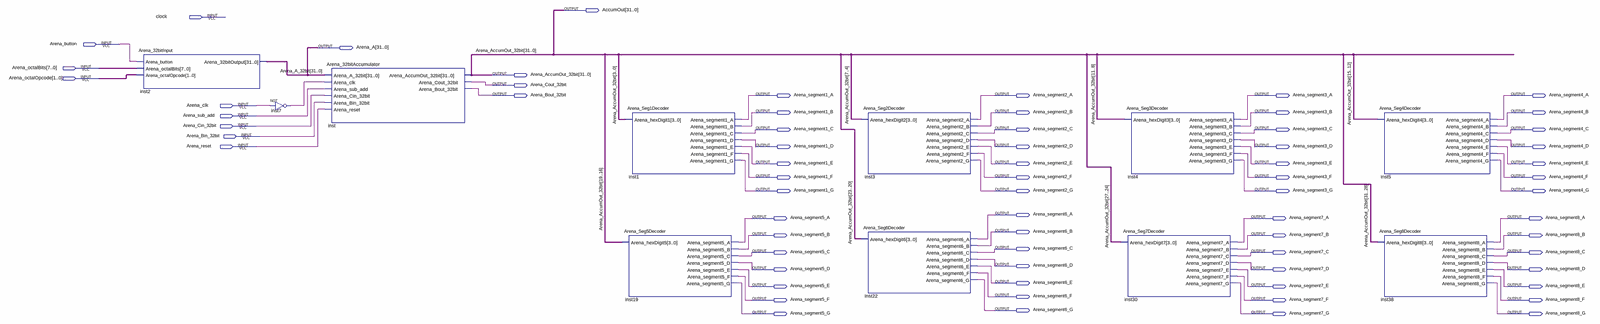
[diagram p0: schematic sheet, whole]
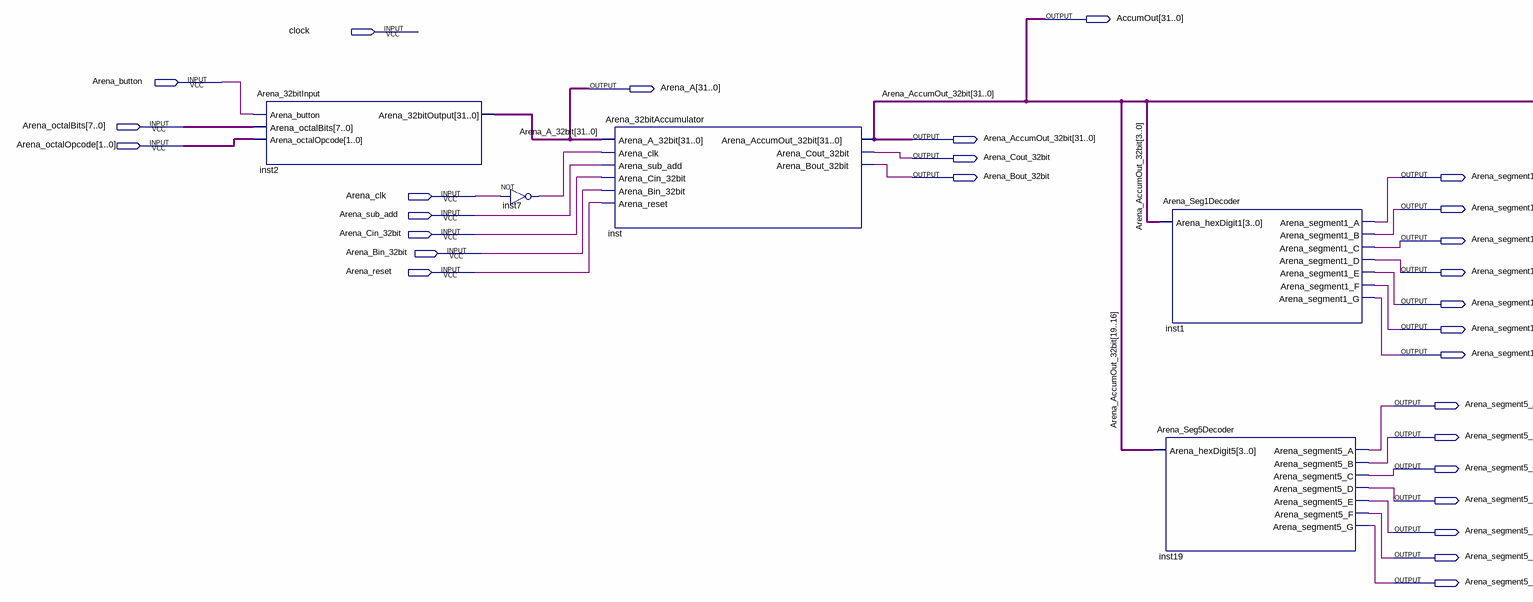
[diagram p1: schematic sheet, left part]
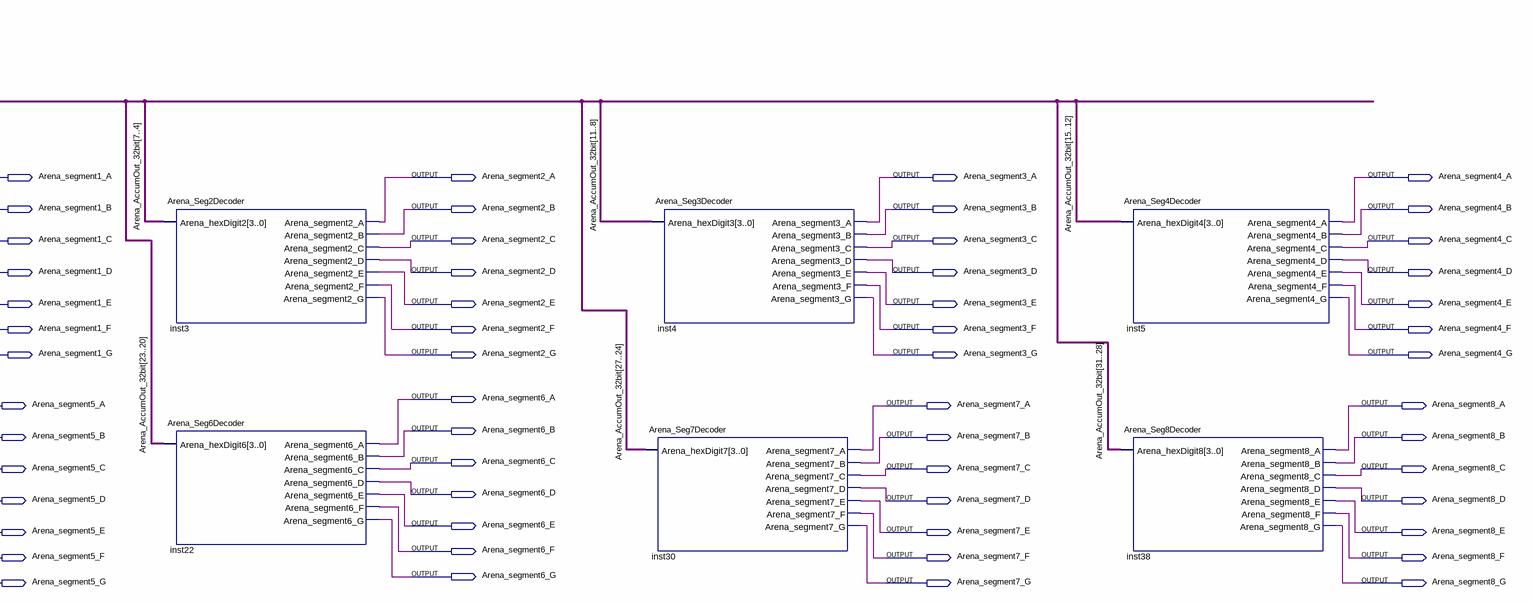
[diagram p2: schematic sheet, right part]
// Quartus schematic Arena_32bitAccumulator_withSegmentDisplay.bdf as structural Verilog: 11 symbols, 70 pins
module Arena_32bitAccumulator_withSegmentDisplay (
  input  clock,
  input  Arena_button,
  input  [7:0] Arena_octalBits,
  input  [1:0] Arena_octalOpcode,
  input  Arena_clk,
  input  Arena_sub_add,
  input  Arena_Cin_32bit,
  input  Arena_Bin_32bit,
  input  Arena_reset,
  output [31:0] AccumOut,
  output [31:0] Arena_A,
  output [31:0] Arena_AccumOut_32bit,
  output Arena_Cout_32bit,
  output Arena_Bout_32bit,
  output Arena_segment1_A,
  output Arena_segment2_A,
  output Arena_segment3_A,
  output Arena_segment4_A,
  output Arena_segment1_B,
  output Arena_segment2_B,
  output Arena_segment3_B,
  output Arena_segment4_B,
  output Arena_segment1_C,
  output Arena_segment2_C,
  output Arena_segment3_C,
  output Arena_segment4_C,
  output Arena_segment1_D,
  output Arena_segment2_D,
  output Arena_segment3_D,
  output Arena_segment4_D,
  output Arena_segment1_E,
  output Arena_segment2_E,
  output Arena_segment3_E,
  output Arena_segment4_E,
  output Arena_segment1_F,
  output Arena_segment2_F,
  output Arena_segment3_F,
  output Arena_segment4_F,
  output Arena_segment1_G,
  output Arena_segment2_G,
  output Arena_segment3_G,
  output Arena_segment4_G,
  output Arena_segment6_A,
  output Arena_segment5_A,
  output Arena_segment7_A,
  output Arena_segment8_A,
  output Arena_segment6_B,
  output Arena_segment5_B,
  output Arena_segment7_B,
  output Arena_segment8_B,
  output Arena_segment6_C,
  output Arena_segment5_C,
  output Arena_segment7_C,
  output Arena_segment8_C,
  output Arena_segment6_D,
  output Arena_segment5_D,
  output Arena_segment7_D,
  output Arena_segment8_D,
  output Arena_segment6_E,
  output Arena_segment5_E,
  output Arena_segment7_E,
  output Arena_segment8_E,
  output Arena_segment6_F,
  output Arena_segment5_F,
  output Arena_segment7_F,
  output Arena_segment8_F,
  output Arena_segment6_G,
  output Arena_segment5_G,
  output Arena_segment7_G,
  output Arena_segment8_G
);

  wire inst7_out;

  Arena_32bitInput inst2 (
    .Arena_button(Arena_button), .Arena_octalBits(Arena_octalBits), .Arena_octalOpcode(Arena_octalOpcode),
    .Arena_32bitOutput(Arena_A));
  not inst7 (inst7_out, Arena_clk);
  Arena_32bitAccumulator inst (
    .Arena_A_32bit(Arena_A), .Arena_clk(inst7_out), .Arena_sub_add(Arena_sub_add),
    .Arena_Cin_32bit(Arena_Cin_32bit), .Arena_Bin_32bit(Arena_Bin_32bit), .Arena_reset(Arena_reset),
    .Arena_AccumOut_32bit(AccumOut), .Arena_Cout_32bit(Arena_Cout_32bit), .Arena_Bout_32bit(Arena_Bout_32bit));
  Arena_Seg1Decoder inst1 (
    .Arena_hexDigit1(AccumOut[3:0]), .Arena_segment1_A(Arena_segment1_A),
    .Arena_segment1_B(Arena_segment1_B), .Arena_segment1_C(Arena_segment1_C),
    .Arena_segment1_D(Arena_segment1_D), .Arena_segment1_E(Arena_segment1_E),
    .Arena_segment1_F(Arena_segment1_F), .Arena_segment1_G(Arena_segment1_G));
  Arena_Seg5Decoder inst19 (
    .Arena_hexDigit5(AccumOut[19:16]), .Arena_segment5_A(Arena_segment5_A),
    .Arena_segment5_B(Arena_segment5_B), .Arena_segment5_C(Arena_segment5_C),
    .Arena_segment5_D(Arena_segment5_D), .Arena_segment5_E(Arena_segment5_E),
    .Arena_segment5_F(Arena_segment5_F), .Arena_segment5_G(Arena_segment5_G));
  Arena_Seg2Decoder inst3 (
    .Arena_hexDigit2(AccumOut[7:4]), .Arena_segment2_A(Arena_segment2_A),
    .Arena_segment2_B(Arena_segment2_B), .Arena_segment2_C(Arena_segment2_C),
    .Arena_segment2_D(Arena_segment2_D), .Arena_segment2_E(Arena_segment2_E),
    .Arena_segment2_F(Arena_segment2_F), .Arena_segment2_G(Arena_segment2_G));
  Arena_Seg6Decoder inst22 (
    .Arena_hexDigit6(AccumOut[23:20]), .Arena_segment6_A(Arena_segment6_A),
    .Arena_segment6_B(Arena_segment6_B), .Arena_segment6_C(Arena_segment6_C),
    .Arena_segment6_D(Arena_segment6_D), .Arena_segment6_E(Arena_segment6_E),
    .Arena_segment6_F(Arena_segment6_F), .Arena_segment6_G(Arena_segment6_G));
  Arena_Seg3Decoder inst4 (
    .Arena_hexDigit3(AccumOut[11:8]), .Arena_segment3_A(Arena_segment3_A),
    .Arena_segment3_B(Arena_segment3_B), .Arena_segment3_C(Arena_segment3_C),
    .Arena_segment3_D(Arena_segment3_D), .Arena_segment3_E(Arena_segment3_E),
    .Arena_segment3_F(Arena_segment3_F), .Arena_segment3_G(Arena_segment3_G));
  Arena_Seg7Decoder inst30 (
    .Arena_hexDigit7(AccumOut[27:24]), .Arena_segment7_A(Arena_segment7_A),
    .Arena_segment7_B(Arena_segment7_B), .Arena_segment7_C(Arena_segment7_C),
    .Arena_segment7_D(Arena_segment7_D), .Arena_segment7_E(Arena_segment7_E),
    .Arena_segment7_F(Arena_segment7_F), .Arena_segment7_G(Arena_segment7_G));
  Arena_Seg4Decoder inst5 (
    .Arena_hexDigit4(AccumOut[15:12]), .Arena_segment4_A(Arena_segment4_A),
    .Arena_segment4_B(Arena_segment4_B), .Arena_segment4_C(Arena_segment4_C),
    .Arena_segment4_D(Arena_segment4_D), .Arena_segment4_E(Arena_segment4_E),
    .Arena_segment4_F(Arena_segment4_F), .Arena_segment4_G(Arena_segment4_G));
  Arena_Seg8Decoder inst38 (
    .Arena_hexDigit8(AccumOut[31:28]), .Arena_segment8_A(Arena_segment8_A),
    .Arena_segment8_B(Arena_segment8_B), .Arena_segment8_C(Arena_segment8_C),
    .Arena_segment8_D(Arena_segment8_D), .Arena_segment8_E(Arena_segment8_E),
    .Arena_segment8_F(Arena_segment8_F), .Arena_segment8_G(Arena_segment8_G));

  assign Arena_AccumOut_32bit = AccumOut;

  // Other names for the same wires on the sheet: Arena_A_32bit[31:0] = Arena_A
endmodule
